# Altium schematic sheet Sheet2.SchDoc
size A4; SheetNumber: 1; SheetTotal: 1
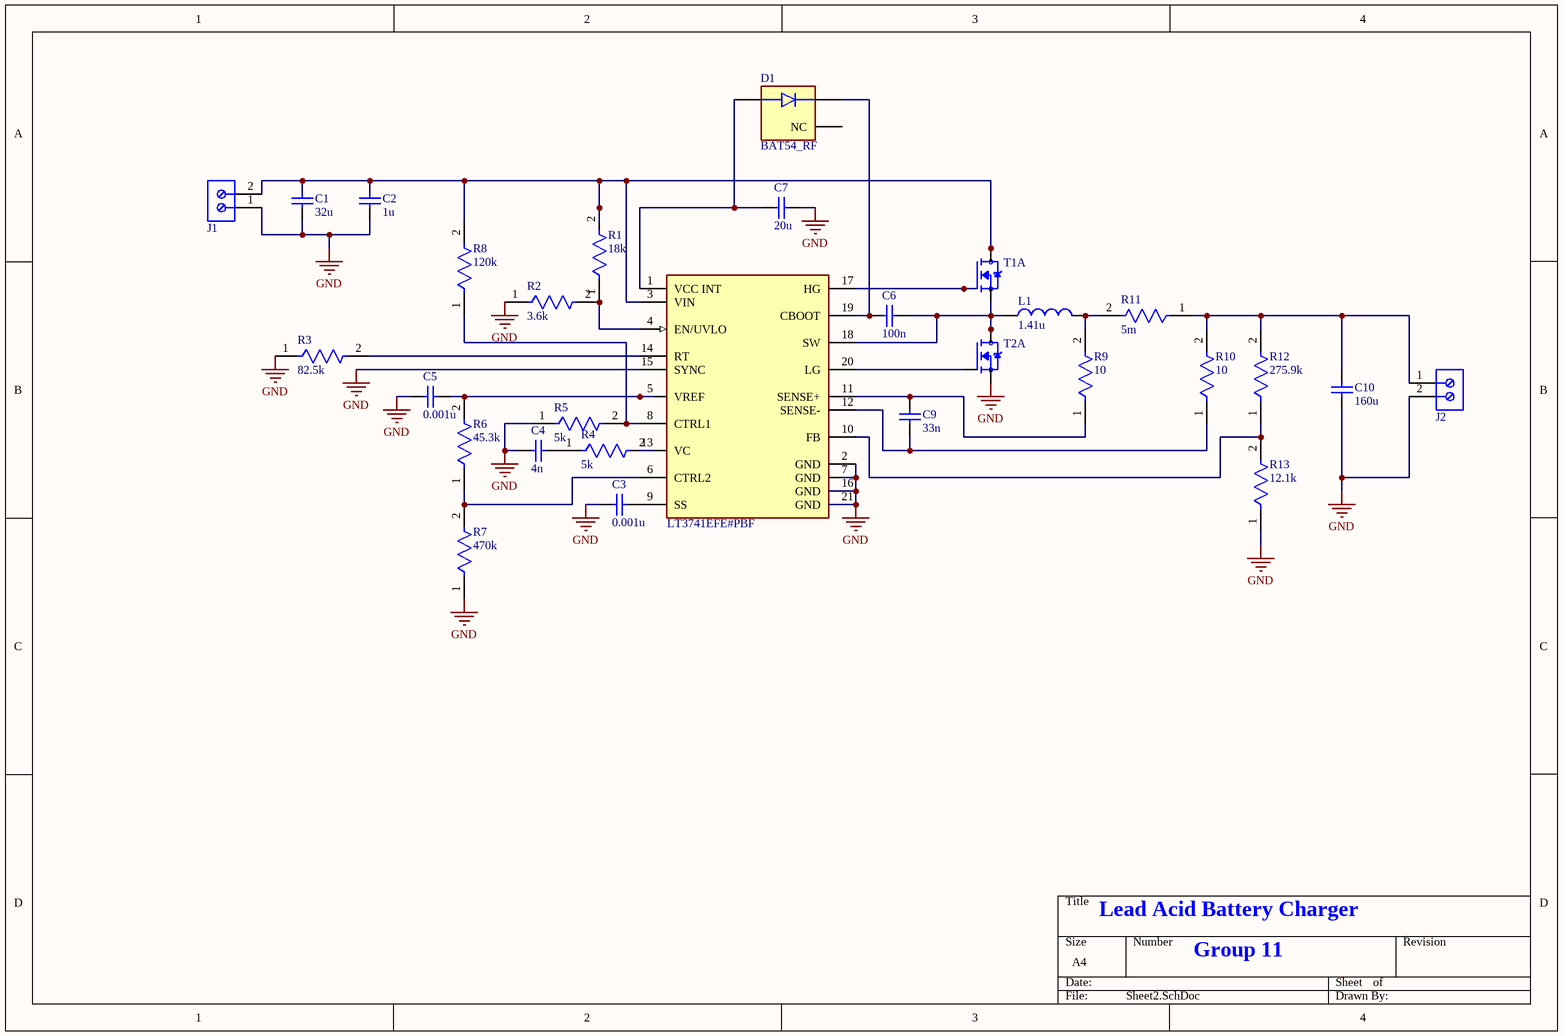
[diagram p0: Sheet2.SchDoc]

## Parts
C1  Capacitance: 32u  [KEMT-C315-THT-2]  (hidden comment: C315C100J2G5TA)
C2  Capacitance: 1u  [KEMT-C315-THT-2]  (hidden comment: C315C100J2G5TA)
C3  Capacitance: 0.001u  [KEMT-C315-THT-2]  (hidden comment: C315C100J2G5TA)
C4  Capacitance: 4n  [KEMT-C315-THT-2]  (hidden comment: C315C100J2G5TA)
C5  Capacitance: 0.001u  [KEMT-C315-THT-2]  (hidden comment: C315C100J2G5TA)
C6  Capacitance: 100n  [KEMT-C315-THT-2]  (hidden comment: C315C100J2G5TA)
C7  Capacitance: 20u  [KEMT-C315-THT-2]  (hidden comment: C315C100J2G5TA)
C9  Capacitance: 33n  [KEMT-C315-THT-2]  (hidden comment: C315C100J2G5TA)
C10  Capacitance: 160u  [KEMT-C315-THT-2]  (hidden comment: C315C100J2G5TA)
D1  BAT54_RF  [SOT95P237X112-3N]
J1  1725656  [PHOE-1725656-2]  (value not drawn)
J2  1725656  [PHOE-1725656-2]  (value not drawn)
L1  Inductance: 1.41u  [IND_7443551131]  (hidden comment: 7443551131)
q2etpo  LT3741EFE#PBF  [FP-FE-20-05-08-1663-CB-IPC_C]
R1  Resistance: 18k  [FP-15FR010E-MFG]  (hidden comment: 15FR010E)
R2  Resistance: 3.6k  [FP-15FR010E-MFG]  (hidden comment: 15FR010E)
R3  Resistance: 82.5k  [FP-15FR010E-MFG]  (hidden comment: 15FR010E)
R4  Resistance: 5k  [FP-15FR010E-MFG]  (hidden comment: 15FR010E)
R5  Resistance: 5k  [FP-15FR010E-MFG]  (hidden comment: 15FR010E)
R6  Resistance: 45.3k  [FP-15FR010E-MFG]  (hidden comment: 15FR010E)
R7  Resistance: 470k  [FP-15FR010E-MFG]  (hidden comment: 15FR010E)
R8  Resistance: 120k  [FP-15FR010E-MFG]  (hidden comment: 15FR010E)
R9  Resistance: 10  [FP-15FR010E-MFG]  (hidden comment: 15FR010E)
R10  Resistance: 10  [FP-15FR010E-MFG]  (hidden comment: 15FR010E)
R11  Resistance: 5m  [FP-15FR010E-MFG]  (hidden comment: 15FR010E)
R12  Resistance: 275.9k  [FP-15FR010E-MFG]  (hidden comment: 15FR010E)
R13  Resistance: 12.1k  [FP-15FR010E-MFG]  (hidden comment: 15FR010E)
T1  CSD88539ND  [SOIC127P600X175-8N]  (value not drawn)  (part A of 2)
T2  CSD88539ND  [SOIC127P600X175-8N]  (value not drawn)  (part A of 2)

## Nets
GND: C1.1 C2.1 C3.1 C4.1 C5.1 C7.1 C10.1 J1.1 J2.2 q2etpo.2(GND) q2etpo.7(GND) q2etpo.15(SYNC) q2etpo.16(GND) q2etpo.21(GND) R2.1 R3.1 R5.1 R7.1 R13.1 T2.1(S1)
NetC1_2: C1.2 C2.2 J1.2 q2etpo.3(VIN) R1.2 R8.2 T1.7(D1) T1.8(D1)
NetC3_2: C3.2 q2etpo.9(SS)
NetC4_2: C4.2 R4.1
NetC5_2: C5.2 q2etpo.5(VREF) R6.2
NetC6_1: C6.1 L1.1 q2etpo.18(SW) T1.1(S1) T2.7(D1) T2.8(D1)
NetC6_2: C6.2 D1.3(K) q2etpo.19(CBOOT)
NetC7_2: C7.2 D1.1(A) q2etpo.1(VCC_INT)
NetC9_1: C9.1 q2etpo.11(SENSE+) R9.1
NetC9_2: C9.2 q2etpo.12(SENSE-) R10.1
NetC10_2: C10.2 J2.1 R10.2 R11.1 R12.2
NetL1_2: L1.2 R9.2 R11.2
Netq2etpo_4: q2etpo.4(EN/UVLO) R1.1 R2.2
Netq2etpo_6: q2etpo.6(CTRL2) R6.1 R7.2
Netq2etpo_8: q2etpo.8(CTRL1) R5.2 R8.1
Netq2etpo_10: q2etpo.10(FB) R12.1 R13.2
Netq2etpo_13: q2etpo.13(VC) R4.2
Netq2etpo_14: q2etpo.14(RT) R3.2
Netq2etpo_17: q2etpo.17(HG) T1.2(G1)
Netq2etpo_20: q2etpo.20(LG) T2.2(G1)

Not connected (* = marked no-connect by the designer): D1 2(NC)

## Notes on the sheet
- Lead Acid Battery Charger
- Group 11

## Library data of the parts
C1-C7 C9 C10 = CMP-1664-00009-1: Capacitor, Ceramic, 10 pF, +/-5 %, 200 V, 2-Pin THD, RoHS, Bulk; Case\Package: DIP; Nominal Gain Bandwith Product: 700 KHz; Nominal Supply Current: 1.2 mA; Min Supply Voltage: 1.5 V; Output Current: 30 mA; Max Supply Voltage: 16 V; Nominal Voltage Gain: 100 dB; Nominal Supply Voltage: 5 V; Slew Rate: 0.3 V\us; Channels: 2; Common Mode Rejection Ratio: 65 dB; Max Operating Temperature: 70 degC; Pins: 8; ComponentLink2Description: Datasheet; REACH SVHC: No SVHC; ComponentLink1Description: Manufacturer URL; Radiation Hardening: No; Packaging: Rail/Tube; ComponentLink1URL: http://www.kemet.com/; Unity Gain Bandwidth Product: 700 KHz; RoHSCompliant: true; Mount: Through Hole; Bandwidth: 700 KHz; Min Dual Supply Voltage: 1.5 V; PackageDescription: 2-Pin Through Hole Device, Body 3.81 x 2.54 mm; Max Dual Supply Voltage: 16 V; DatasheetVersion: Aug-16; Package Quantity: 50; Min Operating Temperature: 0 degC; PackageReference: C315-THT-2; ComponentLink2URL: http://capacitoredge.kemet.com/capedge2/DataSheet/Datasheet-C315C100J2G5TA.pdf?pn=C315C100J2G5TA{BULK}
J1 J2 = CMP-2000-05299-1: Male Header, Pitch 2.54 mm, 1 x 2 Position, Height 9 mm, Tail Length 3.5 mm; Manufacturer: Phoenix Contact; Number of contacts: 2; Content: 250pc(s); Pitch: 2.54mm; Industrial packaging: Yes; Colour: Green; Manufacturer part No.: 1725656; Type: MPT0,5/2-2,54; Datasheet URL: http://datasheet.octopart.com/1725656-Phoenix-Contact-datasheet-5302866.pdf; Manufacturer URL: http://www.phoenixcontact.com/; Datasheet Version: Apr-08
L1 = 7443551131: 13ÂµH Shielded Wirewound Inductor 10A 11.2mOhm Nonstandard; MF: Wurth Electronics; SnapEDA_Link: https://www.snapeda.com/parts/7443551131/Wurth%20Electronics%20Inc./view-part/1449219/?ref=snap; Value: *; Price: None; Availability: Unavailable; Mouser-Purchase-URL: https://snapeda.com/shop?store=Mouser&id=1449219; MP: 7443551131; DigiKey-Purchase-URL: https://snapeda.com/shop?store=DigiKey&id=1449219; Package: Nonstandard Wurth Electronics
q2etpo = CMP-0477-00146-2: IC REG CTRLR BUCK 20TSSOP; Number of Outputs: 1; Min Input Voltage: 6V; Max Supply Voltage: 36V; Switching Frequency: 1.07MHz; Max Output Current: 20A; Output Type: Fixed; Min Output Voltage: 0V; Max Output Voltage: 34V; Efficiency: 94%; REACH SVHC: No SVHC; RoHS Compliant: Yes; Number of Pins: 20; Max Operating Temperature: 125°C; Package Quantity: 74; Packaging: Rail/Tube; Width: 4.5mm; Radiation Hardening: No; Output Current: 20A; Max Frequency: 1.07MHz; Series: -; Min Operating Temperature: -40°C; Length: 6.6mm; Max Input Voltage: 36V; Case/Package: TSSOP; Min Supply Voltage: 6V; Height: 1.05mm
R1-R13 = CMP-33362-000004-1: RES 0.01 OHM 5W 1% AXIAL; Voltage Rating: 100mV; Lead Diameter: 0.05mm; Lead Length: 39.7mm; Voltage Rating (DC): 1kV; Temperature Coefficient: 100ppm/°C; Voltage Rating (AC): 220mV; Package Quantity: 10; Power Rating: 5W; Diameter: 8.4mm; Packaging: Bulk; Termination: Axial; Min Operating Temperature: -55°C; Max Operating Temperature: 275°C; Length: 23.8mm; RoHS Compliant: Yes; Lead Free: Lead Free; Mount: Through Hole; Max Power Dissipation: 5W; Tolerance: 1%; Case/Package: Axial; Number of Terminations: 2; Resistor Type: Metal Element
T1 T2 = CSD88539ND: 60V, N ch NexFET MOSFET, dual SO-8, 28mOhm 8-SOIC -55 to 150; Package: None; Price: None; Value: *; MP: CSD88539ND; Availability: Unavailable
D1 = BAT54_RF: Value: *; Price: None; Availability: Unavailable; MP: BAT54_RF; Package: None